# EAGLE design simple_con_pcb (EAGLE 9.6.2)
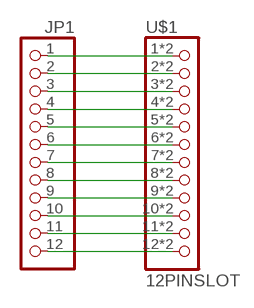
[diagram p0: schematic, sheet 1]

## Parts
JP1  PINHD-1X12  [1X12]
U$1  12PINSLOT  [1X12_SLOT]

## Nets
N$1: JP1.1 U$1.1 U$1.P$1
N$2: JP1.2 U$1.2 U$1.P$2
N$3: JP1.3 U$1.3 U$1.P$3
N$4: JP1.4 U$1.4 U$1.P$4
N$5: JP1.5 U$1.5 U$1.P$5
N$6: JP1.6 U$1.6 U$1.P$6
N$7: JP1.7 U$1.7 U$1.P$7
N$8: JP1.8 U$1.8 U$1.P$8
N$9: JP1.9 U$1.9 U$1.P$9
N$10: JP1.10 U$1.10 U$1.P$10
N$11: JP1.11 U$1.11 U$1.P$11
N$12: JP1.12 U$1.12 U$1.P$12

## Library data of the parts
JP1 = pinhead:PINHD-1X12: PIN HEADER
U$1 = pinhead:12PINSLOT

## Board
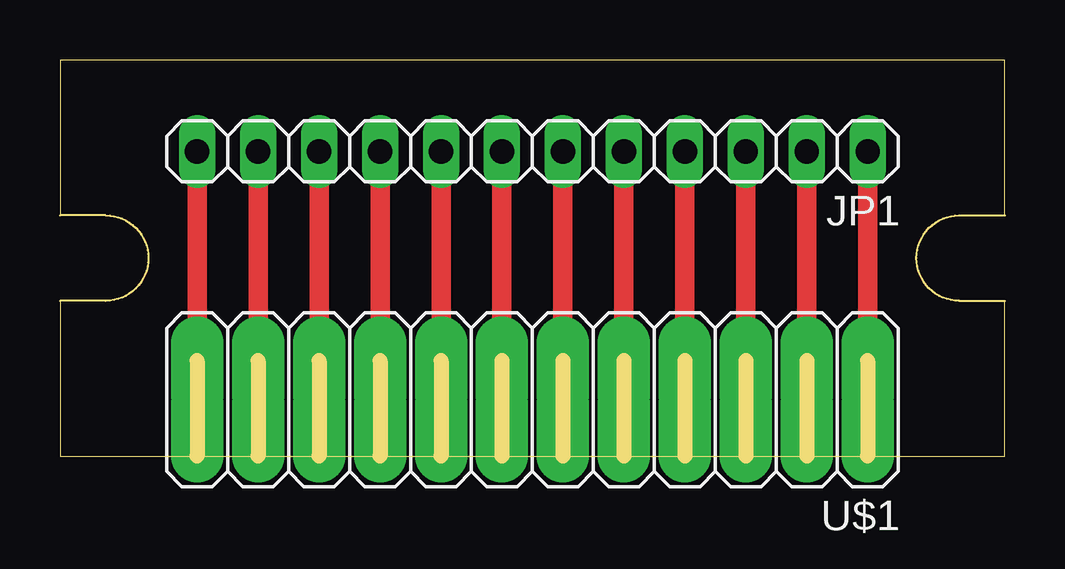
[diagram p1: board, top side]
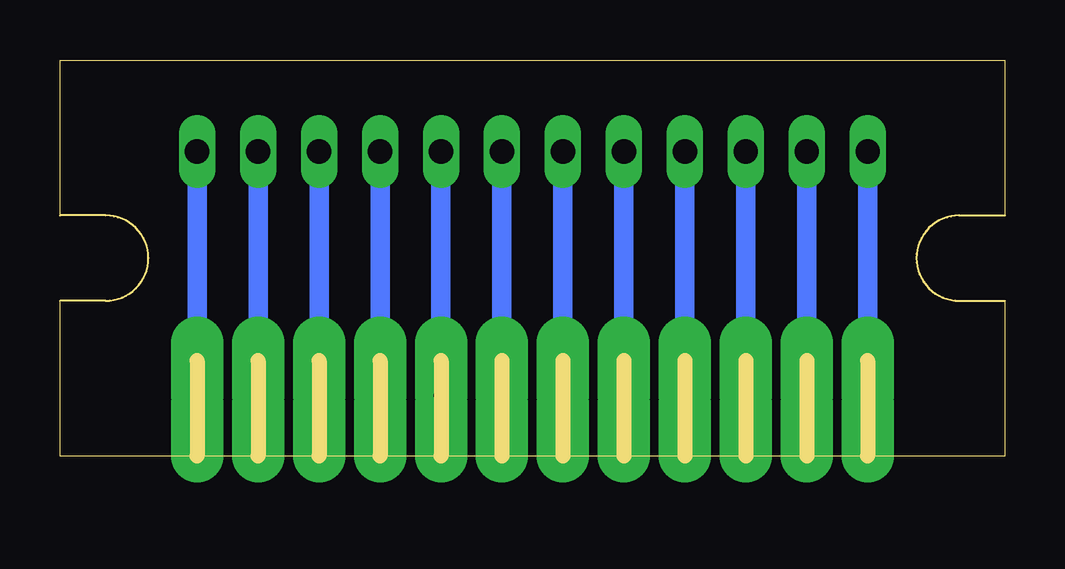
[diagram p2: board, bottom side, seen from below]

Size 39.37 x 16.51 mm. Coordinates in mm from the lower left corner, seen from the top.
Outline: 0,0 39.37,0 39.37,6.48 37.47,6.48 arc-180 37.47,10.03 39.37,10.03 39.37,16.51 0,16.51 0,10.03 1.91,10.03 arc-180 1.91,6.48 0,6.48 0,0
Copper layers (1*16): Top 0.035mm / dielectric 1.5mm / Bottom 0.035mm
Design rules "default": minimum track width 6mil, minimum drill 0.35mm, track to track 6mil, track to pad 6mil, pad to pad 6mil, via to via 6mil, smd to smd 6mil, copper to edge 40mil, drill to drill 6mil, minimum pad ring 10mil, minimum via ring 8mil, stop-mask expansion 4mil, vias tented up to drill 0mil, thermal gap 10mil

### Footprints (pad centres in the part's own frame; a part is rotated, then mirrored left to right if it is on the bottom)
1X12 = drill 1.016 long: 1 -13.97,0; 2 -11.43,0; 3 -8.89,0; 4 -6.35,0; 5 -3.81,0; 6 -1.27,0; 7 1.27,0; 8 3.81,0; 9 6.35,0; 10 8.89,0; 11 11.43,0; 12 13.97,0
1X12_SLOT = drill 0.5 pad 2.184 offset: 1 -13.97,0; 2 -11.43,0; 3 -8.89,0; 4 -6.35,0; 5 -3.81,0; 6 -1.27,0; 7 1.27,0; 8 3.81,0; 9 6.35,0; 10 8.89,0; 11 11.43,0; 12 13.97,0; P$1 -13.97,-2.54; P$2 -11.43,-2.54; P$3 -8.89,-2.54; P$4 -6.35,-2.54; P$6 -1.27,-2.54; P$7 1.27,-2.54; P$8 3.81,-2.54; P$9 6.35,-2.54; P$10 8.89,-2.54; P$11 11.43,-2.54; P$12 13.97,-2.54 | drill 0.6 pad 2.184 offset: P$5 -3.81,-2.54

### Placement (x,y rotation side)
JP1  19.68,12.7 180 top
U$1  19.68,0 180 top

### Tracks (layer width: path | path; a pad name or v marks a point on that pad's centre or on a via)
N$1  (1 unrouted)
  Top 0.813: U$1.1 JP1.1
  Bottom 0.813: U$1.1 JP1.1
N$2  (1 unrouted)
  Top 0.813: U$1.2 JP1.2
  Bottom 0.813: U$1.2 JP1.2
N$3  (1 unrouted)
  Top 0.813: U$1.3 JP1.3
  Bottom 0.813: U$1.3 JP1.3
N$4  (1 unrouted)
  Top 0.813: U$1.4 JP1.4
  Bottom 0.813: U$1.4 JP1.4
N$5  (1 unrouted)
  Top 0.813: U$1.5 JP1.5
  Bottom 0.813: U$1.5 JP1.5
N$6  (1 unrouted)
  Top 0.813: U$1.6 JP1.6
  Bottom 0.813: U$1.6 JP1.6
N$7  (1 unrouted)
  Top 0.813: U$1.7 JP1.7
  Bottom 0.813: U$1.7 JP1.7
N$8  (1 unrouted)
  Top 0.813: U$1.8 JP1.8
  Bottom 0.813: U$1.8 JP1.8
N$9  (1 unrouted)
  Top 0.813: U$1.9 JP1.9
  Bottom 0.813: U$1.9 JP1.9
N$10  (1 unrouted)
  Top 0.813: U$1.10 JP1.10
  Bottom 0.813: U$1.10 JP1.10
N$11  (1 unrouted)
  Top 0.813: U$1.11 JP1.11
  Bottom 0.813: U$1.11 JP1.11
N$12  (1 unrouted)
  Top 0.813: U$1.12 JP1.12
  Bottom 0.813: U$1.12 JP1.12